# EasyEDA Pro project 校赛123.eprj, board PCB5
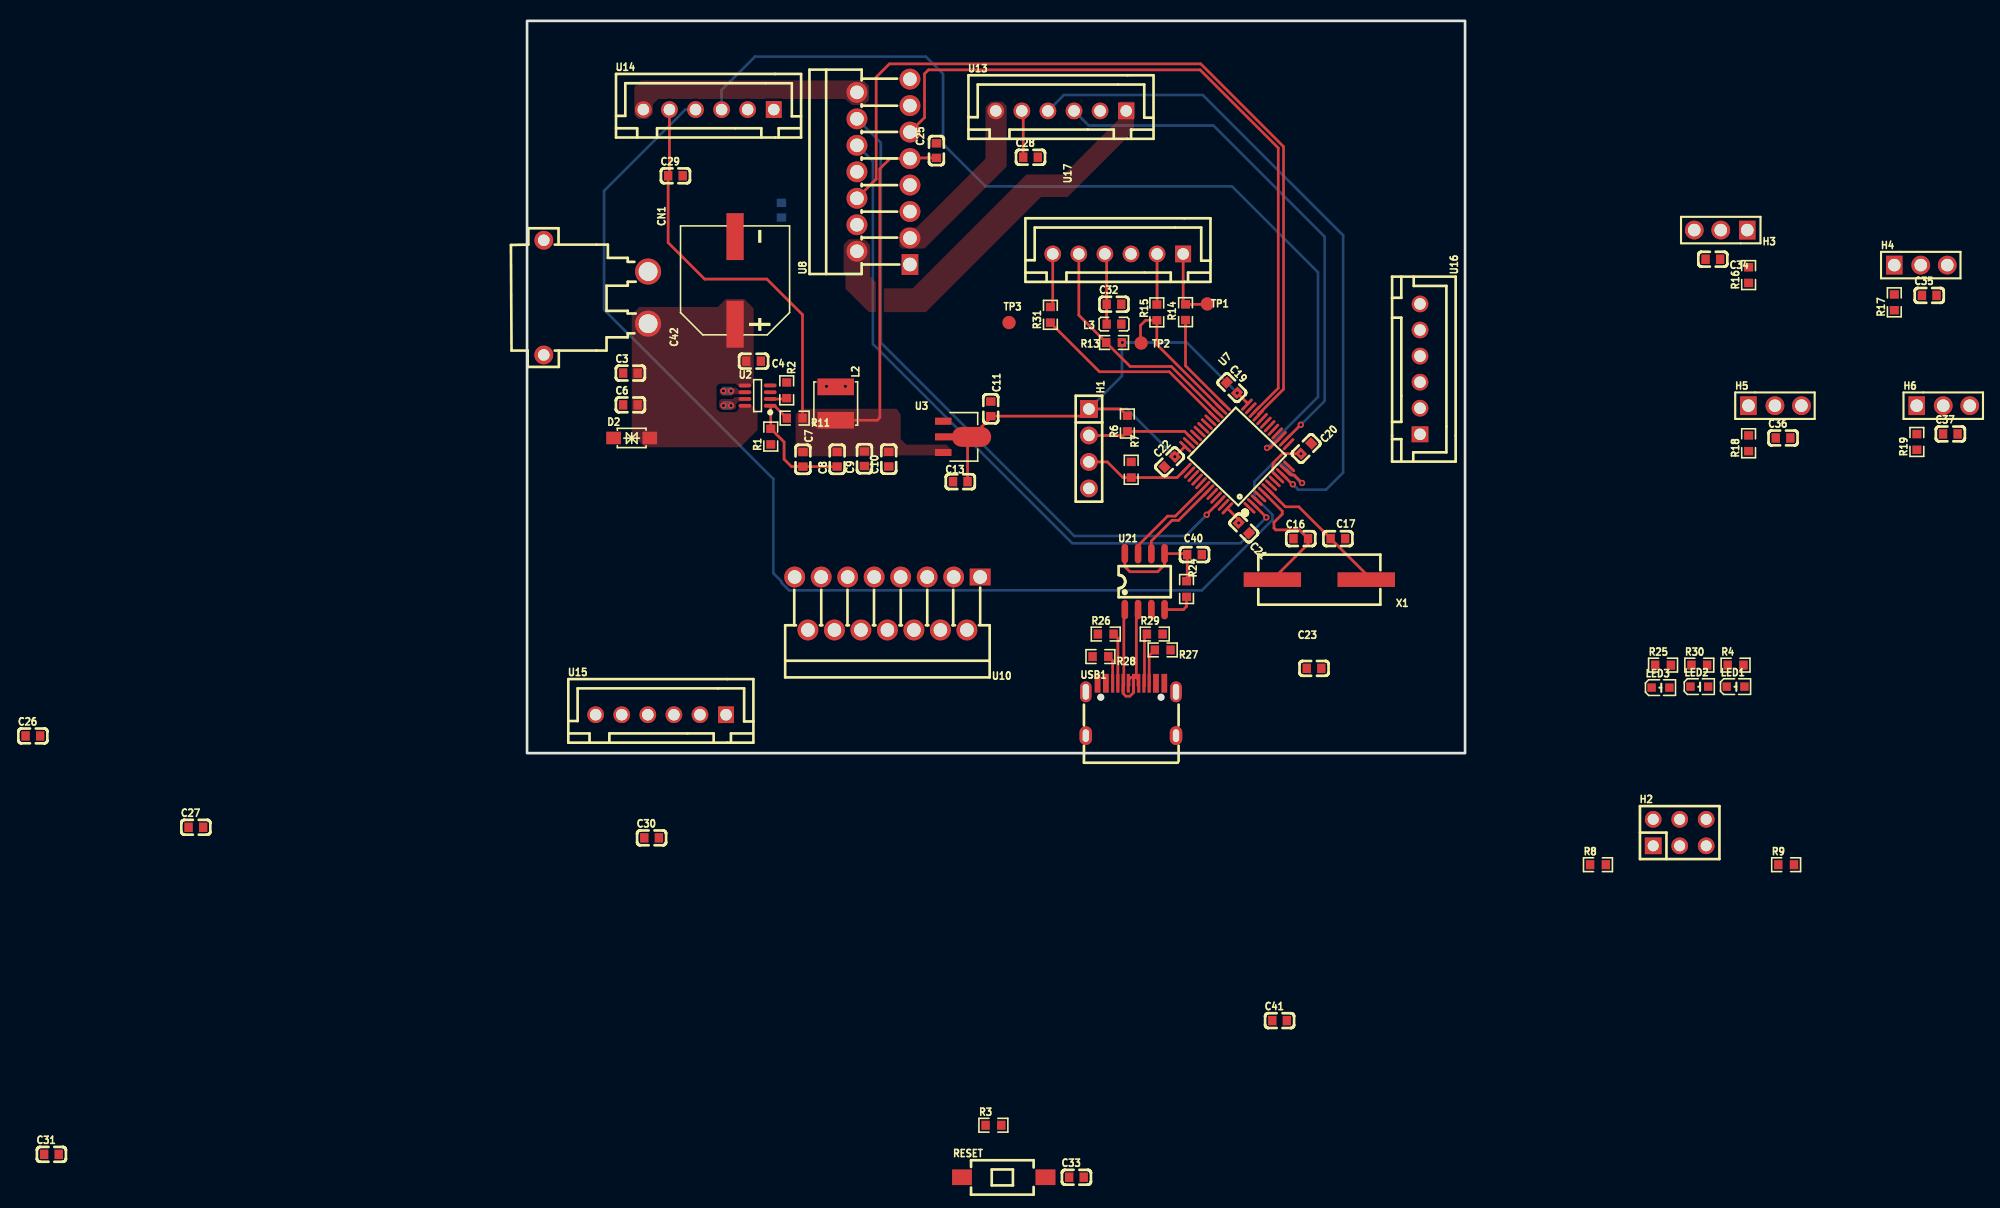
[diagram p2: board, top side]
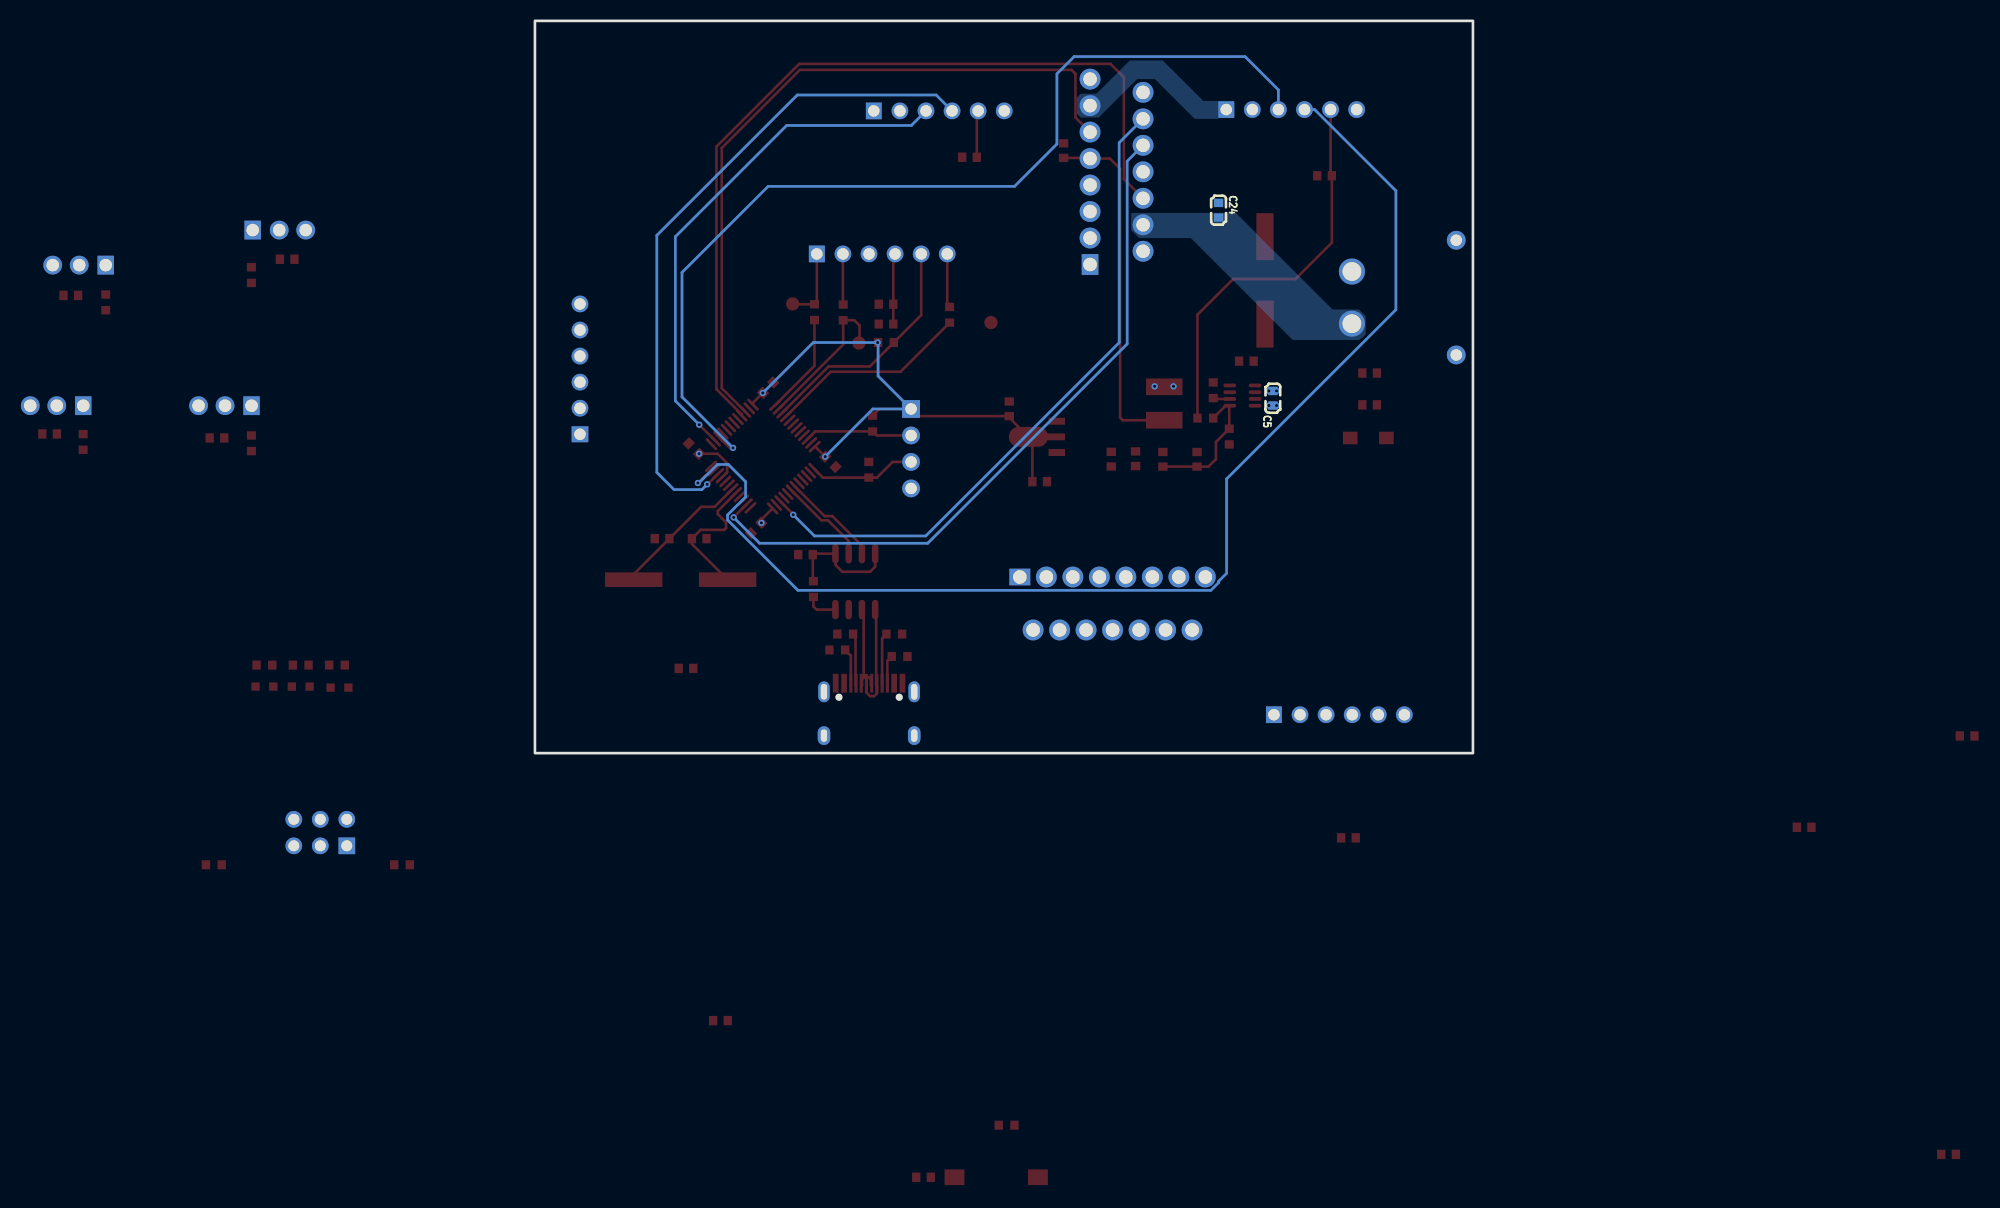
[diagram p3: board, bottom side, seen from below]

Outline 89.92 x 70.23 mm; copper layers: Top Layer, Bottom Layer. Coordinates in mm from the lower left corner of the outline.
Outline path: rectangle 0,70.23 89.92,0
Stack: Top Layer 0.035mm / Dielectric1 1.51mm FR4 er 4.5 / Bottom Layer 0.035mm

## Design rules (mm)
net OSCIN: DP1
net OSCOUT: DP1
net TX: DP3
net RX: DP3
net $1N28060: DP2
net $1N28058: DP2
template: 自定义配置
spacing copperThickness1oz (default): track to track 0.102, other pairs 0.152 to 0.3
spacing copperThickness2oz: track to track 0.203, other pairs 0.152 to 0.3
track width copperThickness1oz (default): min 0.127, default 0.254, max 2.54
track width copperThickness2oz: min 0.203, default 0.254, max 2.54
differential pair differentialPair (default): width min 0.127, default 0.254, max 2.54; gap min 0.152, default 0.152
via viaSize (default): diameter min 0.5, default 0.61, max 10; hole min 0.3, default 0.305, max 6.3

## Placement (name value [footprint] x y rotation side)
C3  100nF  [C0603]  9.91 36.45 0 top
C4  4.7uF  [C0603]  21.72 37.59 180 top
C5  10nF  [C0603]  19.18 34.04 90 bottom
C6  100nF  [C0603]  9.91 33.4 0 top
C7  22uF  [C0603]  26.45 28.18 270 top
C8  100nF  [C0603]  29.73 28.18 90 top
C9  22uF  [C0603]  32.34 28.24 90 top
C10  22uF  [C0603]  34.67 28.19 90 top
C11  100nF  [C0603]  44.45 33.02 270 top
C13  10uF  [C0603]  41.53 26.03 0 top
C16  18pF  [C0603]  74.16 20.57 0 top
C17  18pF  [C0603]  77.73 20.57 180 top
C19  100nF  [C0603]  67.56 35.05 315 top
C20  100nF  [C0603]  74.68 29.21 225 top
C21  100nF  [C0603]  68.71 21.59 135 top
C22  100nF  [C0603]  61.59 27.94 45 top
C23  47uF  [C0603]  75.44 8.13 0 top
C24  100nF  [C0603]  24.38 52.07 270 bottom
C25  100nF  [C0603]  39.24 57.78 90 top
C26  100nF  [C0603]  -47.37 1.65 0 top
C27  100nF  [C0603]  -31.75 -7.11 0 top
C28  100nF  [C0603]  48.26 57.15 0 top
C29  100nF  [C0603]  14.22 55.37 0 top
C30  100nF  [C0603]  11.94 -8.13 0 top
C31  100nF  [C0603]  -45.59 -38.48 0 top
C32  100nF  [C0603]  56.26 43.05 0 top
C33  10uF  [C0603]  52.66 -40.68 0 top
C34  10pF  [C0603]  113.66 47.37 180 top
C35  10pF  [C0603]  134.41 43.9 0 top
C36  10pF  [C0603]  120.4 30.23 0 top
C37  10pF  [C0603]  136.43 30.61 0 top
C40  100nF  [C0603]  63.98 19.04 0 top
C41  100nF  [C0603]  72.14 -25.65 0 top
C42  470uF  [CAP-SMD_BD10.0-L10.3-W10.3-LS11.0]  19.94 45.34 90 top
CN1  XT30PW-M30.G.Y  [CONN-TH_XT30PW-M]  6.6 43.69 270 top
D2  SMF24CA  [SOD-123FL_L2.7-W1.8-LS3.8-BI]  10.03 30.23 0 top
H1  PZ254V-11-04P  [HDR-TH_4P-P2.54-V-M]  53.86 29.2 270 top
H2  2.54-2*3  [HDR-TH_6P-P2.54-V-R2-C3-S2.54_A2541WV-2X3P]  110.49 -7.62 0 top
H3  2.54-1*3P针  [HDR-TH_3P-P2.54-V-M-1]  114.43 50.17 180 top
H4  2.54-1*3P针  [HDR-TH_3P-P2.54-V-M-1]  133.6 46.81 0 top
H5  2.54-1*3P针  [HDR-TH_3P-P2.54-V-M-1]  119.62 33.32 0 top
H6  2.54-1*3P针  [HDR-TH_3P-P2.54-V-M-1]  135.75 33.32 0 top
L2  15uH  [IND-SMD_L4.0-W4.0]  29.59 33.53 270 top
L3  GZ1608D601TF  [L0603]  56.26 41.15 180 top
LED1  SZYY0603R  [LED0603-R-RD]  115.84 6.38 0 top
LED2  SZYY0603R  [LED0603-R-RD]  112.37 6.38 0 top
LED3  SZYY0603R  [LED0603-R-RD]  108.65 6.28 0 top
R1  10.2kΩ  [R0603]  23.36 30.36 90 top
R2  68kΩ  [R0603]  24.89 34.8 270 top
R3  10kΩ  [R0603]  44.7 -35.69 0 top
R4  10kΩ  [R0603]  115.84 8.44 0 top
R6  10kΩ  [R0603]  57.54 31.61 90 top
R7  10kΩ  [R0603]  57.91 27.18 270 top
R8  10kΩ  [R0603]  102.66 -10.7 0 top
R9  10kΩ  [R0603]  120.69 -10.7 0 top
R11  75kΩ  [R0603]  25.65 32.13 180 top
R13  10kΩ  [R0603]  56.27 39.38 180 top
R14  22Ω  [R0603]  63.12 42.29 90 top
R15  22Ω  [R0603]  60.37 42.27 90 top
R16  220Ω  [R0603]  117.09 45.85 90 top
R17  220Ω  [R0603]  131.06 43.23 90 top
R18  220Ω  [R0603]  117.09 29.72 90 top
R19  220Ω  [R0603]  133.22 29.84 90 top
R24  10kΩ  [R0603]  63.22 15.74 90 top
R25  33kΩ  [R0603]  108.89 8.44 0 top
R26  5.1kΩ  [R0603]  55.47 11.42 0 top
R27  5.1kΩ  [R0603]  60.93 9.9 180 top
R28  10kΩ  [R0603]  54.96 9.26 180 top
R29  10kΩ  [R0603]  60.17 11.42 0 top
R30  10kΩ  [R0603]  112.37 8.44 0 top
R31  22Ω  [R0603]  50.16 42.04 90 top
RESET  TS-1101-C-W  [SW-SMD_L6.0-W3.3-LS8.0]  45.7 -40.68 0 top
TP1  -  [Test-Point-0.5mm]  65.21 43.08 180 top
TP2  -  [Test-Point-0.5mm]  58.87 39.33 0 top
TP3  -  [Test-Point-0.5mm]  46.2 41.29 0 top
U2  SY8303AIC  [TSOT-23-8_L2.9-W1.6-P0.65-LS2.8-BR]  22.1 34.29 0 top
U3  AMS1117-3.3  [SOT-89-3_L4.5-W2.5-P1.50-LS4.2-BR]  41.25 30.33 180 top
U7  STM32F103C8T6  [LQFP-48_L7.0-W7.0-P0.50-LS9.0-BL]  68.07 28.45 46.4 top
U8  L298N  [MULTIWATT-15_L19.6-W5.0-P1.27-L]  34.16 55.75 90 top
U10  L298N  [MULTIWATT-15_L19.6-W5.0-P1.27-L]  34.54 14.35 180 top
U13  ZX-XH2.54-6PZZ  [CONN-TH_6P-P2.50_ZX-XH2.54-6PZZ]  51.18 61.59 0 top
U14  ZX-XH2.54-6PZZ  [CONN-TH_6P-P2.50_ZX-XH2.54-6PZZ]  17.4 61.72 0 top
U15  ZX-XH2.54-6PZZ  [CONN-TH_6P-P2.50_ZX-XH2.54-6PZZ]  12.83 3.68 0 top
U16  ZX-XH2.54-6PZZ  [CONN-TH_6P-P2.50_ZX-XH2.54-6PZZ]  85.6 36.83 270 top
U17  ZX-XH2.54-6PZZ  [CONN-TH_6P-P2.50_ZX-XH2.54-6PZZ]  56.64 47.88 0 top
U21  CH340N  [SOP-8_L4.9-W3.9-P1.27-LS6.0-BL]  59.21 16.45 0 top
USB1  TYPE-C 16PIN 2MD(073)  [USB-C-SMD_TYPE-C-6PIN-2MD-073]  57.88 4.05 0 top
X1  8MHz  [CRYSTAL-SMD_L11.4-W4.7-LS12.7]  75.95 16.64 180 top

## Footprints (pads in the part's own frame, mm; a bottom-side part is the same pattern mirrored in y, then rotated)
C0603
  rect 0.8x0.9 smd: 1(-0.7,0) 2(0.7,0)
CAP-SMD_BD10.0-L10.3-W10.3-LS11.0
  rect 4.5x1.65 smd: 1(-4.2,0) 2(4.2,0)
CONN-TH_6P-P2.50_ZX-XH2.54-6PZZ
  rect 1.524x1.6 hole 1.1: 1(6.25,0)
  round 1.6 hole 1.1: 2(3.75,0) 3(1.25,0) 4(-1.25,0) 5(-3.75,0) 6(-6.25,0)
CONN-TH_XT30PW-M
  round 2.5 hole 1.8: 1(-2.5,5) 2(2.5,5)
  round 1.8 hole 1.1: 3(5.5,-5) 4(-5.5,-5)
CRYSTAL-SMD_L11.4-W4.7-LS12.7
  rect 5.5x1.4 smd: 1(-4.5,0) 2(4.5,0)
HDR-TH_3P-P2.54-V-M-1
  rect 1.575x1.8 hole 1.2: 1(-2.54,0)
  round 1.8 hole 1.2: 2(0,0) 3(2.54,0)
HDR-TH_4P-P2.54-V-M
  rect 1.7x1.7 hole 1.1: 1(-3.81,0)
  round 1.7 hole 1.1: 2(-1.27,0) 3(1.27,0) 4(3.81,0)
HDR-TH_6P-P2.54-V-R2-C3-S2.54_A2541WV-2X3P
  rect 1.6x1.6 hole 1.05: 1(-2.54,-1.27)
  round 1.6 hole 1.05: 2(-2.54,1.27) 3(0,-1.27) 4(0,1.27) 5(2.54,-1.27) 6(2.54,1.27)
IND-SMD_L4.0-W4.0
  rect 1.6x3.5 smd: 1(-1.6,0) 2(1.6,0)
L0603
  rect 0.8x0.864 smd: 1(-0.7,0) 2(0.7,0)
LED0603-R-RD
  rect 0.8x0.8 smd: 1(0.851,0) 2(-0.851,0)
LQFP-48_L7.0-W7.0-P0.50-LS9.0-BL
  oval 0.27x1.5 smd: 1(-2.75,-4.25) 2(-2.25,-4.25) 3(-1.75,-4.25) 4(-1.25,-4.25) 5(-0.75,-4.25) 6(-0.25,-4.25) 7(0.25,-4.25) 8(0.75,-4.25) 9(1.25,-4.25) 10(1.75,-4.25) 11(2.25,-4.25) 12(2.75,-4.25) 25(2.75,4.25) 26(2.25,4.25) 27(1.75,4.25) 28(1.25,4.25) 29(0.75,4.25) 30(0.25,4.25) 31(-0.25,4.25) 32(-0.75,4.25) 33(-1.25,4.25) 34(-1.75,4.25) 35(-2.25,4.25) 36(-2.75,4.25)
  oval 1.5x0.27 smd: 13(4.25,-2.75) 14(4.25,-2.25) 15(4.25,-1.75) 16(4.25,-1.25) 17(4.25,-0.75) 18(4.25,-0.25) 19(4.25,0.25) 20(4.25,0.75) 21(4.25,1.25) 22(4.25,1.75) 23(4.25,2.25) 24(4.25,2.75) 37(-4.25,2.75) 38(-4.25,2.25) 39(-4.25,1.75) 40(-4.25,1.25) 41(-4.25,0.75) 42(-4.25,0.25) 43(-4.25,-0.25) 44(-4.25,-0.75) 45(-4.25,-1.25) 46(-4.25,-1.75) 47(-4.25,-2.25) 48(-4.25,-2.75)
MULTIWATT-15_L19.6-W5.0-P1.27-L
  rect 2x1.6 hole 1.3: 1(-8.89,-2.54)
  round 2 hole 1.3: 2(-7.62,2.54) 3(-6.35,-2.54) 4(-5.08,2.54) 5(-3.81,-2.54) 6(-2.54,2.54) 7(-1.27,-2.54) 8(0,2.54) 9(1.27,-2.54) 10(2.54,2.54) 11(3.81,-2.54) 12(5.08,2.54) 13(6.35,-2.54) 14(7.62,2.54) 15(8.89,-2.54)
R0603
  rect 0.806x0.864 smd: 1(-0.753,0) 2(0.753,0)
SOD-123FL_L2.7-W1.8-LS3.8-BI
  rect 1.4x1.2 smd: 1(-1.735,0) 2(1.735,0)
SOP-8_L4.9-W3.9-P1.27-LS6.0-BL
  oval 0.63x1.865 smd: 1(-1.905,-2.683) 2(-0.635,-2.683) 3(0.635,-2.683) 4(1.905,-2.683) 5(1.905,2.683) 6(0.635,2.683) 7(-0.635,2.683) 8(-1.905,2.683)
SOT-89-3_L4.5-W2.5-P1.50-LS4.2-BR
  rect 1.575x0.672 smd: 1(1.356,-1.5) 3(1.356,1.5)
  custom 5.377x1.9 smd: 2(-1.356,0)
SW-SMD_L6.0-W3.3-LS8.0
  rect 1.9x1.5 smd: 1(-4,0) 2(4,0)
Test-Point-0.5mm
  round 1.27 smd: 1(0,0)
TSOT-23-8_L2.9-W1.6-P0.65-LS2.8-BR
  oval 1.222x0.364 smd: 1(1.211,-0.975) 2(1.211,-0.325) 3(1.211,0.325) 4(1.211,0.975) 5(-1.211,0.975) 6(-1.211,0.325) 7(-1.211,-0.325) 8(-1.211,-0.975)
USB-C-SMD_TYPE-C-6PIN-2MD-073
  rect 0.55x1.8 smd: 1(-3.2,2.647) 2(-2.4,2.647) 11(2.4,2.647) 12(3.2,2.647)
  rect 0.3x1.8 smd: 3(-1.75,2.647) 4(-1.25,2.647) 5(-0.75,2.647) 6(-0.25,2.647) 7(0.25,2.647) 8(0.75,2.647) 9(1.25,2.647) 10(1.75,2.647)
  oval 1.1x2 hole 0.6x1.5: 13(-4.325,1.825) 14(4.325,1.825)
  oval 1.2x1.8 hole 0.6x1.2: 13(-4.325,-2.375) 14(4.325,-2.375)

## Nets
As in the schematic.

Pads without a net: U7 29 30

## Via types
v1: diameter 0.61, hole 0.305, Top Layer to Bottom Layer, 17 vias

## Routing (per net, layer and track width the routed paths; a pad name or vN(x,y) marks a point on that pad's centre or on a via; arc(x,y) is an arc through that point)
VCC_3V3: length 72.5
  Top Layer w0.254: C13.2 42.23,29.96 U3.2 44.45,32.18 C11.2 53.17,32.32 H1.1 56.9,33.01 R6.2 ; v1(62.09,28.44) 63.04,29.39 63.1,29.39 ; v1(68.21,22.08) 68.21,22.39 67.13,23.47 ; 68.06,34.56 69.01,33.6 U7.24 ; v1(74.18,28.72) 72.4,28.72 71.5,27.81 71.5,27.38 71.5,27.38 71.5,26.94 U7.9 ; R24.2 63.28,16.55 C40.1 63.19,19.13 U21.5 61.11,18.06 60.45,17.4 57.78,17.4 57.3,17.88 U21.8
  Bottom Layer w0.254: v1(57.06,39.38) 63.24,39.38 v1(68.07,34.54) ; 57.02,39.37 57.02,36.17 H1.1 57.52,33.01 v1(62.09,28.44)
VCC_5V: length 77
  Top Layer w0.254: C28.1 47.56,61.47 U13.5 ; U14.5 13.65,55.5 C29.1 13.52,48.96 17.02,45.47 22.99,45.47 26.41,42.05 R11.1 ; L2.2 33.57,31.93 33.82,32.18 33.82,56.05 34.8,57.02 U8.9 36.76,57.08 C25.1
LDA: length 119.3
  Top Layer w0.254: U7.11 72.8,27.15 73.28,26.67 73.53,26.67 v1(74.29,25.91)
  Bottom Layer w0.254: U14.4 15.17,61.72 7.39,53.93 7.39,42.53 23.61,26.3 23.61,17.25 24.38,16.49 24.38,16.36 25.12,15.61 64.7,15.61 71.45,22.36 71.45,22.85 69.72,24.58 69.72,26.03 71.37,27.69 72.42,27.69 74.2,25.91 v1(74.29,25.91)
LDB: length 93.5
  Top Layer w0.254: v1(70.93,29.27) 71.23,29.27 U7.15
  Bottom Layer w0.254: U14.3 18.65,63.61 21.84,66.8 38.23,66.8 39.88,65.15 39.88,58.42 43.94,54.36 67.56,54.36 75.82,46.1 75.82,34.16 v1(70.93,29.27)
LDIN1: length 68.2
  Top Layer w0.254: v1(70.87,22.61) 70.87,22.62 U7.2
  Bottom Layer w0.254: U8.10 33.15,56.77 33.15,39.24 52.26,20.13 68.39,20.13 v1(70.87,22.61)
LDIN2: length 64
  Top Layer w0.254: 66.41,24.16 65.15,22.91 v1(65.15,22.86)
  Bottom Layer w0.254: U8.12 33.91,58.55 33.91,39.37 52.45,20.83 63.12,20.83 v1(65.15,22.86)
LDPWM: length 69.6
  Top Layer w0.254: U7.22 72.01,35.01 72.01,58.04 64.52,65.53 38.48,65.53 38.1,65.15 38.1,60.96 U8.11
LUA: length 64.4
  Top Layer w0.254: v1(73.41,25.78) 73.36,25.78 U7.10
  Bottom Layer w0.254: v1(73.41,25.78) 73.91,25.27 76.58,25.27 78.23,26.92 78.23,49.66 64.77,63.12 51.46,63.12 U13.4
LUB: length 50.2
  Top Layer w0.254: v1(74.17,31.5) 72.65,29.97 U7.14
  Bottom Layer w0.254: U13.3 53.83,60.2 65.79,60.2 76.45,49.53 76.45,33.78 v1(74.17,31.5)
LUPWM: length 82
  Top Layer w0.254: U8.6 33.46,55.05 33.46,64.83 34.73,66.1 64.58,66.1 72.52,58.17 72.52,34.91 70.1,32.49 U7.21
OSCIN: length 13.5
  Top Layer w0.254: X1.2 74.87,20.06 C16.2 74.03,21.41 71.78,21.41 71.6,21.59 71.6,22.13 72.39,22.92 72.39,23.22 70.63,24.97
OSCOUT: length 13.4
  Top Layer w0.254: U7.6 72.69,23.62 73.98,23.62 C17.2 80.45,17.16 X1.1
PS2_CLK: length 19.4
  Top Layer w0.254: U7.28 61.56,36.58 54.87,36.58 R31.1
PS2_CMD: length 14.6
  Top Layer w0.254: TP2.1 58.8,39.39 58.8,41.02 59.3,41.52 R15.1 60.37,39.19 U7.26
PS2_DAT: length 9.7
  Top Layer w0.254: R14.1 63.12,37.14 U7.25
PS2_SEL: length 23.1
  Top Layer w0.254: U17.5 52.89,42 57.81,37.08 61.76,37.08 U7.27
RX: length 8.7
  Top Layer w0.254: 65.32,25.2 62.45,22.33 61.82,22.33 59.84,20.34 U21.6
SWCLK: length 10.3
  Top Layer w0.254: H1.3 55.63,27.93 57.13,26.42 R7.2 62.31,26.42 U7.37
SWDIO: length 10.4
  Top Layer w0.254: U7.34 63.04,30.86 R6.1 57.15,30.47 H1.2
TX: length 9.5
  Top Layer w0.254: U21.7 58.57,19.9 61.4,22.73 62.15,22.73 64.96,25.54
$1N1810:
  vias: v1(18.82,34.74) v1(19.56,34.74) v1(28.7,35.18) v1(30.51,35.18)
$1N1826:
  vias: v1(18.82,33.34) v1(19.56,33.34)
$1N2500: length 13.1
  Top Layer w0.254: C8.1 29.72,27.48 C7.2 25.35,27.48 24.64,28.19 24.64,29.84 R1.2 23.36,33.26 U2.1 23.72,33.31 R11.2
$1N2612: length 1.6
  Top Layer w0.254: R2.2 24.81,33.97 U2.2
$1N23002: length 7
  Top Layer w0.254: U17.1 62.89,43.27 R14.2 65.18,43.04 TP1.1
$1N23007: length 5.2
  Top Layer w0.254: U17.6 50.39,43.02 R31.2
$1N23602: length 4.9
  Top Layer w0.254: R15.2 60.39,43.05 U17.2
$1N23821: length 6.8
  Top Layer w0.254: U17.4 55.56,47.71 C32.1 L3.2
$1N27553: length 3.1
  Top Layer w0.254: U21.4 62.92,13.77 63.22,14.07 63.22,14.99
$1N28058: length 9
  Top Layer w0.254: 57.63,6.43 57.71,6.5 57.71,7.1 57.87,7.26 58.4,7.26 ; 58.63,6.43 58.56,6.5 58.56,7.1 58.4,7.26 ; 58.4,7.26 58.4,13.6 U21.2
$1N28060: length 10
  Top Layer w0.254: U21.1 57.21,13.67 57.21,6.5 57.13,6.43 57.13,5.73 57.4,5.46 57.78,5.46 58.13,5.81 58.13,6.43
$1N28062: length 5.2
  Top Layer w0.254: 56.63,6.43 56.63,11.01 R26.2
$1N28063: length 3.7
  Top Layer w0.254: R27.2 59.63,9.35 59.63,6.43
$1N28127: length 5.1
  Top Layer w0.254: R29.1 59.18,11.19 59.18,6.48 59.13,6.43
$1N28131: length 3
  Top Layer w0.254: 56.13,6.43 56.13,8.84 R28.1

## Copper pours and planes (outline as drawn; the poured copper is in the pictures)
VCC_5V on Top Layer: 35.44,33.02 35.69,32.64 35.81,32.51 35.81,30.13 36.35,29.59 40.26,29.59 40.26,29.49 40.64,29.11 40.64,28.58 40.63,28.56 35.16,28.56 35.07,28.47 26.1,28.47 25.74,28.84 25.74,32.47 26.29,33.02
VCC_12V on Top Layer: 10.67,42.8 18.29,42.8 19.05,43.56 20.83,43.56 21.73,42.66 21.73,35.59 21.21,35.07 21.21,35.05 20.36,35.05 19.99,35.43 18.41,35.43 18.16,35.18 18.16,33.02 18.44,32.74 20.04,32.74 20.19,32.89 20.19,33.27 20.45,33.53 21.34,33.53 22.1,32.77 22.1,30.99 20.45,29.34 11.3,29.34 10.03,30.61 10.03,42.04 10.67,42.67
VCC_12V on Bottom Layer: 10.29,41.91 10.92,42.55 13.46,42.55 22.73,51.82 32.9,51.82 32.9,50.29 32,49.4 27.05,49.4 17.27,39.62 10.92,39.62 10.41,40 10.29,40.13
OUTPUT1 on Top Layer: 30.84,49.28 32.32,49.28 32.89,48.71 32.89,45.72 34.04,44.58 36.96,44.58 47.88,55.5 51.44,55.5 56.77,60.83 56.77,62.36 56.64,62.48 58.17,62.48 58.29,62.36 58.29,60.96 58.17,60.83 58.17,59.69 51.82,53.34 49.28,53.34 38.23,42.29 32.77,42.29 30.52,44.54 30.52,45.95 30.35,46.12 30.35,48.79
OUTPUT2 on Top Layer: 35.69,49.91 36.19,50.42 37.34,50.42 43.94,57.02 43.94,61.98 44.45,62.48 45.55,62.48 45.97,62.06 45.97,56.26 38.1,48.39 35.94,48.39 35.69,48.64
OUTPUT3 on Bottom Layer: 24.38,60.83 26.67,60.83 30.48,64.64 32.19,64.64 35.87,60.96 37.59,60.96 37.97,61.34 37.97,62.86 37.59,63.25 36.07,63.25 32.89,66.42 29.72,66.42 25.83,62.54 23.07,62.54 22.89,62.36 22.86,62.36 22.86,61.09 22.99,60.96 24.26,60.96
OUTPUT4 on Top Layer: 10.67,60.83 11.56,60.83 12.06,61.34 12.06,62.23 12.57,62.74 30.48,62.74 31.24,62.1 31.19,62.17 32.32,62.17 32.77,62.61 32.77,64.01 32.26,64.52 10.92,64.52 10.29,63.88 10.29,61.21
$1N1810 on Top Layer: 18.47,34.85 18.67,35.05 20.07,35.05 20.32,34.8 21.4,34.8 21.46,34.73 21.46,34.46 21.38,34.46 21.21,34.29 18.67,34.29 18.54,34.42 18.47,34.42
$1N1810 on Bottom Layer: 31.3,34.32 31.5,34.51 31.5,35.94 31.37,36.07 18.67,36.07 18.42,35.81 18.42,34.32
$1N1826 on Top Layer: 18.78,32.96 19.89,32.96 19.89,32.97 20.07,33.15 20.07,33.53 20.19,33.66 21.34,33.66 21.46,33.78 21.46,34.14 21.36,34.14 21.34,34.16 19.92,34.16 19.72,33.97 18.6,33.97 18.42,33.78 18.42,33.16 18.62,32.96 18.78,32.96
